# Altium schematic sheet Grideye.SchDoc
size A4; SheetNumber: 1; SheetTotal: 8
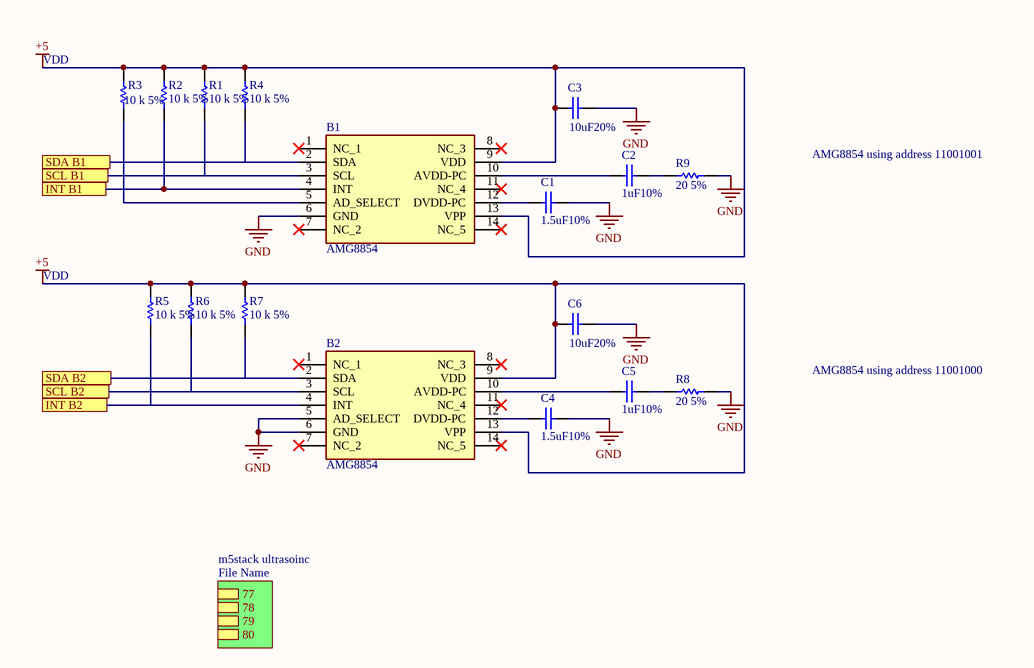
[diagram p0: Grideye.SchDoc]

## Parts
B1  AMG8854  [AMG8854]
B2  AMG8854  [AMG8854]
C1  value 1.5uF10%  (hidden comment: Capacitor)
C2  value 1uF10%  (hidden comment: Capacitor)
C3  value 10uF20%  (hidden comment: Capacitor)
C4  value 1.5uF10%  (hidden comment: Capacitor)
C5  value 1uF10%  (hidden comment: Capacitor)
C6  value 10uF20%  (hidden comment: Capacitor)
R1  value 10 k 5%  (hidden comment: Resistor)
R2  value 10 k 5%  (hidden comment: Resistor)
R3  value 10 k 5%  (hidden comment: Resistor)
R4  value 10 k 5%  (hidden comment: Resistor)
R5  value 10 k 5%  (hidden comment: Resistor)
R6  value 10 k 5%  (hidden comment: Resistor)
R7  value 10 k 5%  (hidden comment: Resistor)
R8  value 20 5%  (hidden comment: Resistor)
R9  value 20 5%  (hidden comment: Resistor)

## Sub-sheets
m5stack ultrasoinc = File Name: 77, 78, 79, 80

## Ports
INT B1, INT B2, SCL B1, SCL B2, SDA B1, SDA B2

## Nets
+5: B1.9(VDD) B1.13(VPP) B2.9(VDD) B2.13(VPP) C3.1 C6.1 R1.2 R2.2 R3.2 R4.2 R5.2 R6.2 R7.2
GND: B1.6(GND) B2.5(AD_SELECT) B2.6(GND) C1.2 C3.2 C4.2 C6.2 R8.2 R9.2
NetB1_2: B1.2(SDA) R4.1
NetB1_3: B1.3(SCL) R1.1
NetB1_4: B1.4(INT) R2.1
NetB1_5: B1.5(AD_SELECT) R3.1
NetB1_10: B1.10(AVDD-PC) C2.1
NetB1_12: B1.12(DVDD-PC) C1.1
NetB2_2: B2.2(SDA) R7.1
NetB2_3: B2.3(SCL) R6.1
NetB2_4: B2.4(INT) R5.1
NetB2_10: B2.10(AVDD-PC) C5.1
NetB2_12: B2.12(DVDD-PC) C4.1
NetC2_2: C2.2 R9.1
NetC5_2: C5.2 R8.1

Not connected (* = marked no-connect by the designer): B1 1(NC_1)* 7(NC_2)* 8(NC_3)* 11(NC_4)* 14(NC_5)*; B2 1(NC_1)* 7(NC_2)* 8(NC_3)* 11(NC_4)* 14(NC_5)*

## Notes on the sheet
- VDD
- AMG8854 using address 11001001
- AMG8854 using address 11001000

## Library data of the parts
B1 B2 = AMG8854: Product: Infrared Array Sensor Grid-EYE, Series/Type: AMG88xx (High performance type), Number of pixel: 64 (Vertical 8 x Horizontal 8 Matrix), Operating voltage (DC) (V): 5, Viewing angle (): 60, Amplification factor: Low gain, Mounting form: Surface Mount Type; Manufacturer_Name: Panasonic; Geometry.Height: 4.3mm; Mouser Part Number: 667-AMG8854; Mouser Price/Stock: https://www.mouser.co.uk/ProductDetail/Panasonic/AMG8854?qs=sSYV1F9c5cGiWvzHDbpBOw%3D%3D; Manufacturer_Part_Number: AMG8854; Datasheet Link: https://industrial.panasonic.com/cdbs/www-data/pdf/ADI8000/ADI8000C66.pdf
C1-C6 = Capacitor: SimulationGenericComponent: True
R1-R9 = Resistor: TC1: 0; SimulationGenericComponent: True; TC2: 0